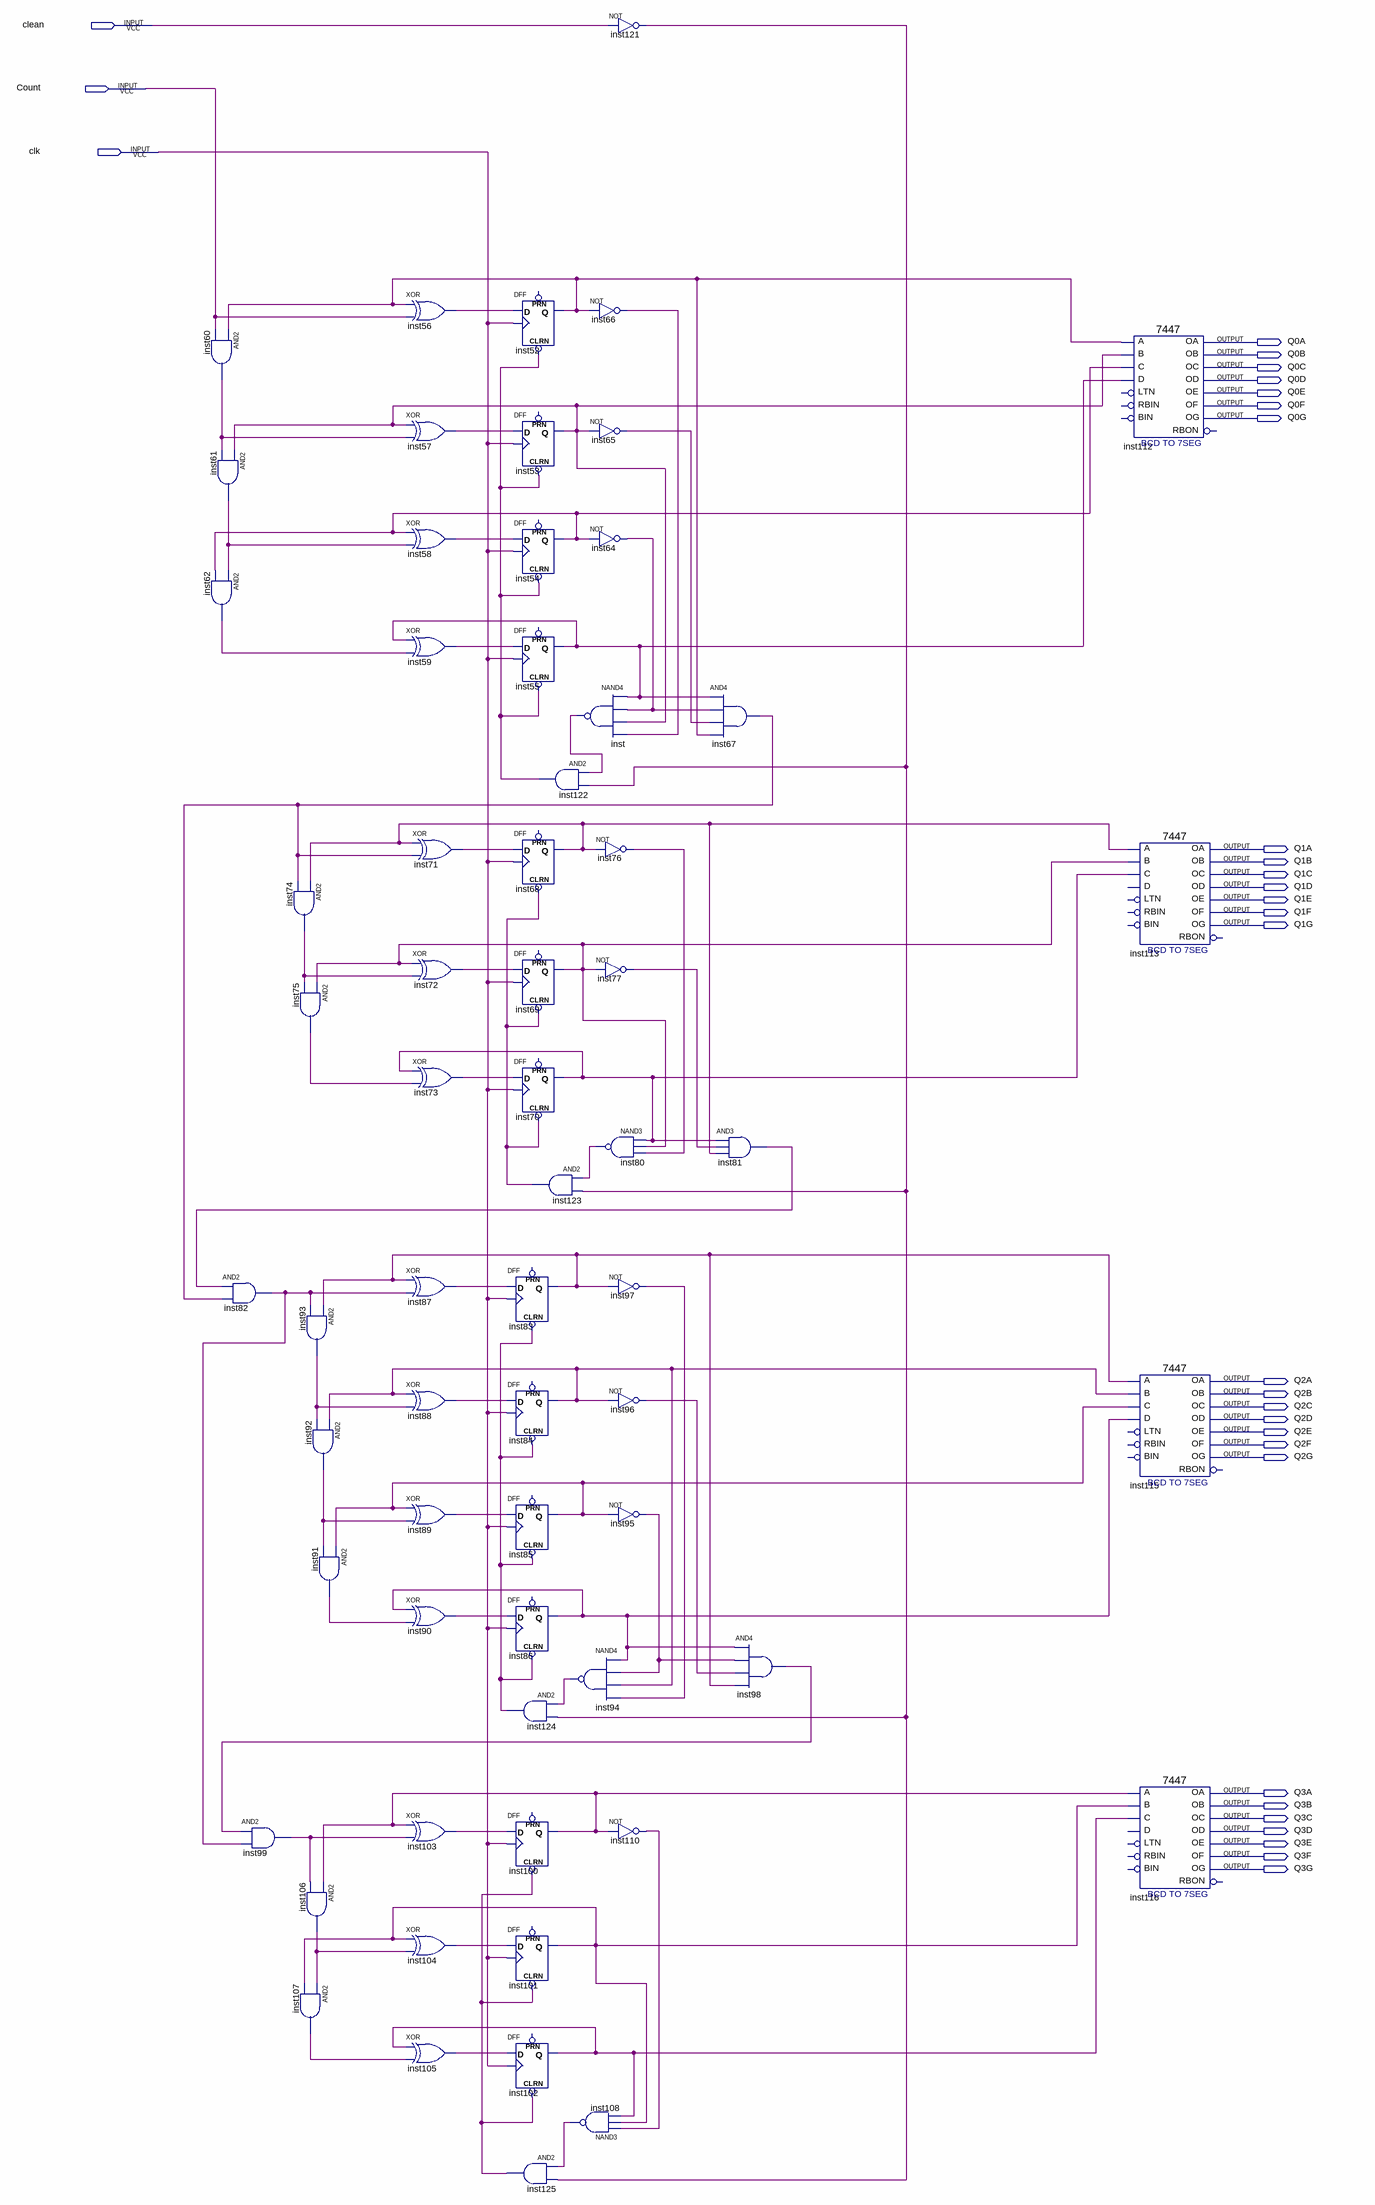
[diagram p0: schematic sheet]
// Quartus schematic lab05.bdf as structural Verilog: 65 symbols, 31 pins
module lab05 (
  input  clean,
  input  Count,
  input  clk,
  output Q0A,
  output Q0B,
  output Q0C,
  output Q0D,
  output Q0E,
  output Q0F,
  output Q0G,
  output Q1A,
  output Q1B,
  output Q1C,
  output Q1D,
  output Q1E,
  output Q1F,
  output Q1G,
  output Q2A,
  output Q2B,
  output Q2C,
  output Q2D,
  output Q2E,
  output Q2F,
  output Q2G,
  output Q3A,
  output Q3B,
  output Q3C,
  output Q3D,
  output Q3E,
  output Q3F,
  output Q3G
);

  wire inst52_q, inst53_q, inst54_q, inst55_q, inst56_out, inst57_out, inst58_out, inst59_out, inst60_out,
       inst61_out, inst62_out, inst64_out, inst65_out, inst66_out, inst67_out, inst68_q, inst69_q, inst70_q,
       inst71_out, inst72_out, inst73_out, inst74_out, inst75_out, inst76_out, inst77_out, inst80_out,
       inst81_out, inst82_out, inst83_q, inst84_q, inst85_q, inst86_q, inst87_out, inst88_out, inst89_out,
       inst90_out, inst91_out, inst92_out, inst93_out, inst94_out, inst95_out, inst96_out, inst97_out,
       inst98_out, inst99_out, inst100_q, inst101_q, inst102_q, inst103_out, inst104_out, inst105_out,
       inst106_out, inst107_out, inst108_out, inst110_out, inst121_out, inst122_out, inst123_out,
       inst124_out, inst125_out, inst_out;

  and inst60 (inst60_out, inst52_q, Count);
  and inst61 (inst61_out, inst53_q, inst60_out);
  and inst62 (inst62_out, inst61_out, inst54_q);
  and inst82 (inst82_out, inst81_out, inst67_out);
  and inst74 (inst74_out, inst68_q, inst67_out);
  and inst99 (inst99_out, inst98_out, inst82_out);
  and inst75 (inst75_out, inst69_q, inst74_out);
  and inst93 (inst93_out, inst83_q, inst82_out);
  and inst92 (inst92_out, inst84_q, inst93_out);
  and inst91 (inst91_out, inst85_q, inst92_out);
  and inst106 (inst106_out, inst100_q, inst99_out);
  and inst107 (inst107_out, inst106_out, inst101_q);
  xor inst56 (inst56_out, inst52_q, Count);
  xor inst57 (inst57_out, inst53_q, inst60_out);
  xor inst58 (inst58_out, inst54_q, inst61_out);
  xor inst59 (inst59_out, inst55_q, inst62_out);
  xor inst71 (inst71_out, inst68_q, inst67_out);
  xor inst72 (inst72_out, inst69_q, inst74_out);
  xor inst73 (inst73_out, inst70_q, inst75_out);
  xor inst87 (inst87_out, inst83_q, inst82_out);
  xor inst88 (inst88_out, inst84_q, inst93_out);
  xor inst89 (inst89_out, inst85_q, inst92_out);
  xor inst90 (inst90_out, inst86_q, inst91_out);
  xor inst103 (inst103_out, inst100_q, inst99_out);
  xor inst104 (inst104_out, inst101_q, inst106_out);
  xor inst105 (inst105_out, inst102_q, inst107_out);
  DFF inst52 (.CLRN(inst122_out), .CLK(clk), .D(inst56_out), .Q(inst52_q));  // open: PRN
  DFF inst53 (.CLRN(inst122_out), .CLK(clk), .D(inst57_out), .Q(inst53_q));  // open: PRN
  DFF inst54 (.CLRN(inst122_out), .CLK(clk), .D(inst58_out), .Q(inst54_q));  // open: PRN
  DFF inst55 (.CLRN(inst122_out), .CLK(clk), .D(inst59_out), .Q(inst55_q));  // open: PRN
  and inst122 (inst122_out, inst_out, inst121_out);
  DFF inst68 (.CLRN(inst123_out), .CLK(clk), .D(inst71_out), .Q(inst68_q));  // open: PRN
  DFF inst69 (.CLRN(inst123_out), .CLK(clk), .D(inst72_out), .Q(inst69_q));  // open: PRN
  DFF inst70 (.CLRN(inst123_out), .CLK(clk), .D(inst73_out), .Q(inst70_q));  // open: PRN
  and inst123 (inst123_out, inst80_out, inst121_out);
  DFF inst83 (.CLRN(inst124_out), .CLK(clk), .D(inst87_out), .Q(inst83_q));  // open: PRN
  DFF inst84 (.CLRN(inst124_out), .CLK(clk), .D(inst88_out), .Q(inst84_q));  // open: PRN
  DFF inst85 (.CLRN(inst124_out), .CLK(clk), .D(inst89_out), .Q(inst85_q));  // open: PRN
  DFF inst86 (.CLRN(inst124_out), .CLK(clk), .D(inst90_out), .Q(inst86_q));  // open: PRN
  and inst124 (inst124_out, inst94_out, inst121_out);
  DFF inst100 (.CLRN(inst125_out), .CLK(clk), .D(inst103_out), .Q(inst100_q));  // open: PRN
  DFF inst101 (.CLRN(inst125_out), .CLK(clk), .D(inst104_out), .Q(inst101_q));  // open: PRN
  DFF inst102 (.CLRN(inst125_out), .CLK(clk), .D(inst105_out), .Q(inst102_q));  // open: PRN
  and inst125 (inst125_out, inst108_out, inst121_out);
  not inst66 (inst66_out, inst52_q);
  not inst65 (inst65_out, inst53_q);
  not inst64 (inst64_out, inst54_q);
  nand inst (inst_out, inst55_q, inst64_out, inst53_q, inst66_out);
  nand inst94 (inst94_out, inst86_q, inst95_out, inst84_q, inst97_out);
  nand inst108 (inst108_out, inst110_out, inst101_q, inst102_q);
  not inst121 (inst121_out, clean);
  not inst76 (inst76_out, inst68_q);
  not inst77 (inst77_out, inst69_q);
  nand inst80 (inst80_out, inst70_q, inst69_q, inst76_out);
  not inst97 (inst97_out, inst83_q);
  not inst96 (inst96_out, inst84_q);
  not inst95 (inst95_out, inst85_q);
  not inst110 (inst110_out, inst100_q);
  and inst67 (inst67_out, inst55_q, inst64_out, inst65_out, inst52_q);
  and inst81 (inst81_out, inst70_q, inst77_out, inst68_q);
  and inst98 (inst98_out, inst86_q, inst95_out, inst96_out, inst83_q);
  \7447  inst112 (
    .B(inst53_q), .C(inst54_q), .D(inst55_q), .A(inst52_q), .OB(Q0B), .OC(Q0C), .OE(Q0E), .OD(Q0D), .OF(Q0F),
    .OG(Q0G), .OA(Q0A));  // open: LTN, RBIN, BIN, RBON
  \7447  inst113 (
    .B(inst69_q), .C(inst70_q), .A(inst68_q), .OB(Q1B), .OC(Q1C), .OE(Q1E), .OD(Q1D), .OF(Q1F), .OG(Q1G),
    .OA(Q1A));  // open: LTN, D, RBIN, BIN, RBON
  \7447  inst115 (
    .B(inst84_q), .C(inst85_q), .D(inst86_q), .A(inst83_q), .OB(Q2B), .OC(Q2C), .OE(Q2E), .OD(Q2D), .OF(Q2F),
    .OG(Q2G), .OA(Q2A));  // open: LTN, RBIN, BIN, RBON
  \7447  inst116 (
    .B(inst101_q), .C(inst102_q), .A(inst100_q), .OB(Q3B), .OC(Q3C), .OE(Q3E), .OD(Q3D), .OF(Q3F), .OG(Q3G),
    .OA(Q3A));  // open: LTN, D, RBIN, BIN, RBON
endmodule
